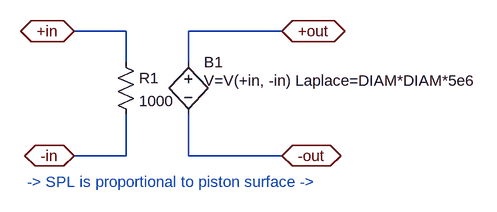
[diagram p0: schematic Piston.asc]
Piston.asc, the LTspice schematic file:
Version 4
SHEET 1 1124 680
WIRE -80 -48 -160 -48
WIRE 160 -48 16 -48
WIRE -80 0 -80 -48
WIRE 16 0 16 -48
WIRE -80 144 -80 80
WIRE -80 144 -160 144
WIRE 16 144 16 80
WIRE 160 144 16 144
FLAG -160 -48 +in
IOPIN -160 -48 BiDir
FLAG -160 144 -in
IOPIN -160 144 BiDir
FLAG 160 -48 +out
IOPIN 160 -48 BiDir
FLAG 160 144 -out
IOPIN 160 144 BiDir
SYMBOL bv 16 -16 R0
WINDOW 3 24 44 Left 0
SYMATTR Value V=V(+in, -in) Laplace=DIAM*DIAM*5e6
SYMATTR InstName B1
SYMBOL res -96 -16 R0
SYMATTR InstName R1
SYMATTR Value 1000
TEXT -232 184 Left 0 ;-> SPL is proportional to piston surface ->

The netlist it stands for:
* Piston.asc
B1 +out -out V=V(+in, -in) Laplace=DIAM*DIAM*5e6
R1 +in -in 1000
* -> SPL is proportional to piston surface ->
.backanno
.end